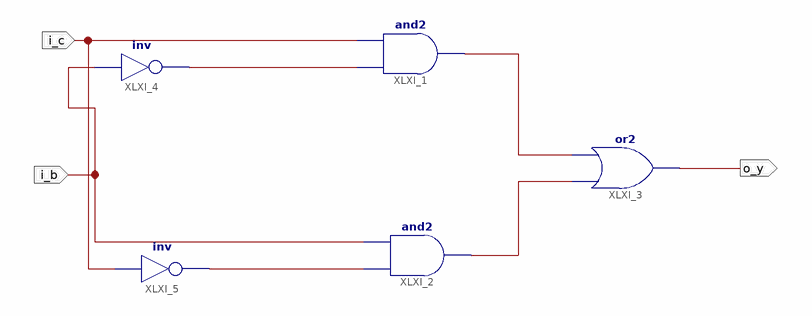
[diagram p0: schematic sheet 1]
// Xilinx ISE schematic Laby4poda.sch (spartan3e) as structural Verilog: 5 symbols, 3 ports
module Laby4poda (
  input  i_b,
  input  i_c,
  output o_y
);

  wire XLXN_1, XLXN_2, XLXN_5, XLXN_7;

  and XLXI_1 (XLXN_2, XLXN_5, i_c);
  and XLXI_2 (XLXN_1, XLXN_7, i_b);
  or XLXI_3 (o_y, XLXN_1, XLXN_2);
  not XLXI_4 (XLXN_5, i_b);
  not XLXI_5 (XLXN_7, i_c);
endmodule
